# Altium schematic sheet crowbar.SchDoc
size A4; SheetNumber: 1; SheetTotal: 1
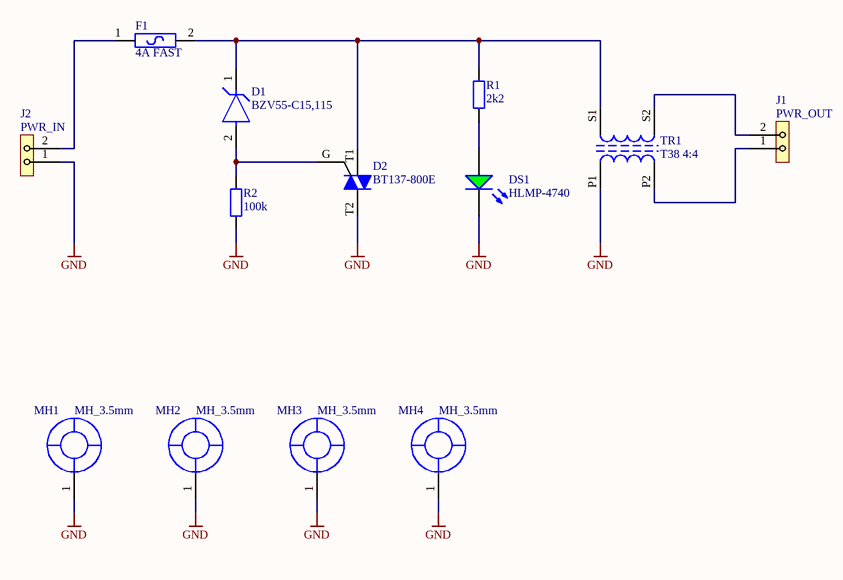
[diagram p0: crowbar.SchDoc]

## Parts
D1  BZV55-C15,115  [FP-SOD80C-MFG]
D2  BT137-800E  [DPAK254P1525X460-3N]
DS1  HLMP-4740  [AVAG-HLMP-4740]
F1  4A FAST  [FUSE_SOCKET_PTF/78]
J1  PWR_OUT  [SOLDER_PAD_1L_2P]
J2  PWR_IN  [SOLDER_PAD_1L_2P]
MH1  MH_3.5mm  [MOUNTING_HOLE_GROUNDED]
MH2  MH_3.5mm  [MOUNTING_HOLE_GROUNDED]
MH3  MH_3.5mm  [MOUNTING_HOLE_GROUNDED]
MH4  MH_3.5mm  [MOUNTING_HOLE_GROUNDED]
R1  Resistance: 2k2  [FP-CRCW1206-e3-IPC_B]  (hidden comment: Resistor)
R2  Resistance: 100k  [FP-CRCW1206-e3-IPC_B]  (hidden comment: Resistor)
TR1  T38 4:4  [TRANSFORMER_TOROID_FLAT]

## Nets
GND: D2.T2 DS1.2(K) J2.1 MH1.1 MH2.1 MH3.1 MH4.1 R2.2 TR1.P1
NetD1_1: D1.1(C) D2.T1 F1.2 R1.1 TR1.S1
NetD1_2: D1.2(A) D2.G R2.1
NetDS1_1: DS1.1(A) R1.2
NetF1_1: F1.1 J2.2
NetJ1_1: J1.1 TR1.P2
NetJ1_2: J1.2 TR1.S2

## Library data of the parts
D1 = CMP-14400-000031-1: DIODE ZENER 15V 500MW LLDS; RoHS Compliant: Yes
D2 = Triac
DS1 = CMP-2000-06413-1: T-1 3/4 (5 mm) Low Current LED Lamp, Green, 1.9 V, -20 to 100 degC, 2-Pin THD, RoHS, Bulk; Manufacturer: AvagoTechnologies; Type: Uni-Color; Peak Wavelength: 565nm; Rad Hard: No; Viewing Angle: 50°; Dominant Wavelength/Color Temperature: 569nm; Number of LEDs: 1; Lens Appearance: ColoredDiffused; Lens Shape Type: Circular; Mounting Orientation: TopMount; Intensity: 2.3mcd; Datasheet Version: 07/2014; Category: LEDs; Datasheet URL: http://docs.avagotech.com/docs/AV02-1557EN; Packaging: Bulk; Pin Count: 2; Mounting Technology: ThroughHole; Package Reference: HLMP-4740; Mounting: ThroughHole; Manufacturer URL: http://www.avagotech.com/; Color: Green; Package: 2T-13/4; Package Description: 2-Pin Through Hole Device, Dia 5.845 mm, Pitch 2.54 mm
F1 = FUSE
J1 J2 = SOLDER_PAD_1_2P
MH1-MH4 = MOUNTING_HOLE_3.5mm_1: 3.5mm grounded mounting hole
R1 R2 = Resistor: EU symbol
TR1 = Transformer: 1 Primer; 1 Seconder